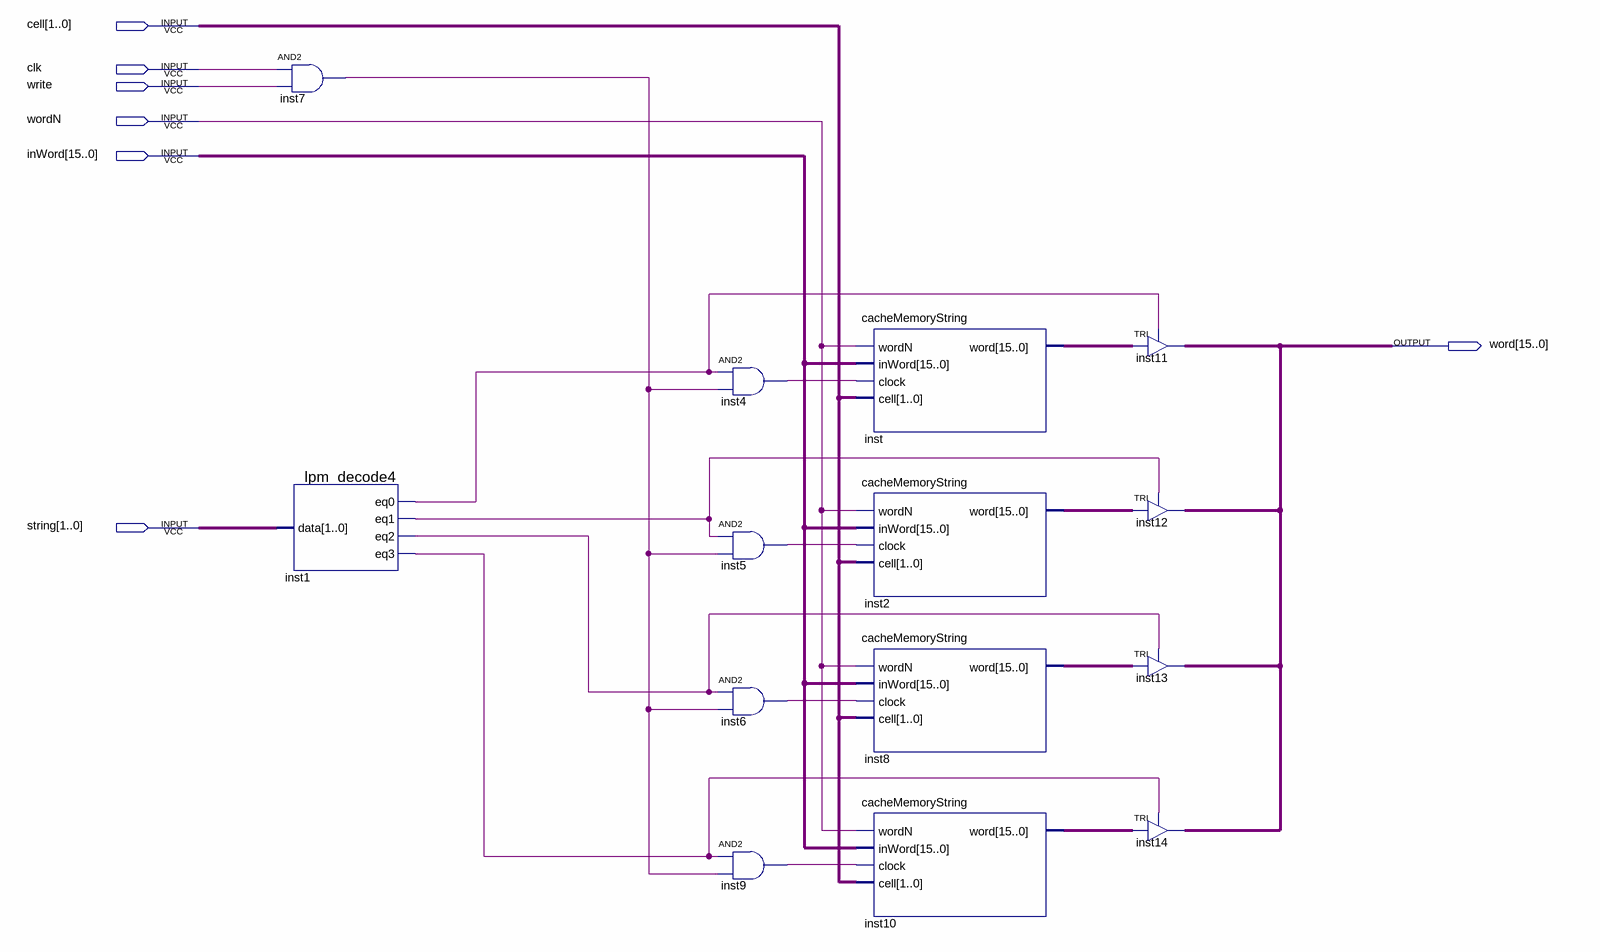
[diagram p0: schematic sheet]
// Quartus schematic cachememory.bdf as structural Verilog: 14 symbols, 7 pins
module cachememory (
  input  [1:0] \cell ,
  input  clk,
  input  write,
  input  wordN,
  input  [15:0] inWord,
  input  [1:0] \string ,
  output [15:0] word
);

  wire inst1_eq0, inst1_eq1, inst1_eq2, inst1_eq3, inst4_out, inst5_out, inst6_out, inst7_out, inst9_out;
  wire [15:0] inst2_word, inst8_word, inst10_word, inst_word;

  and inst7 (inst7_out, clk, write);
  lpm_decode4 inst1 (.data(\string ), .eq0(inst1_eq0), .eq1(inst1_eq1), .eq2(inst1_eq2), .eq3(inst1_eq3));
  and inst4 (inst4_out, inst1_eq0, inst7_out);
  and inst5 (inst5_out, inst1_eq1, inst7_out);
  and inst6 (inst6_out, inst1_eq2, inst7_out);
  and inst9 (inst9_out, inst1_eq3, inst7_out);
  cacheMemoryString inst (.wordN(wordN), .inWord(inWord), .clock(inst4_out), .\cell (\cell ), .word(inst_word));
  cacheMemoryString inst2 (.wordN(wordN), .inWord(inWord), .clock(inst5_out), .\cell (\cell ), .word(inst2_word));
  cacheMemoryString inst8 (.wordN(wordN), .inWord(inWord), .clock(inst6_out), .\cell (\cell ), .word(inst8_word));
  cacheMemoryString inst10 (.wordN(wordN), .inWord(inWord), .clock(inst9_out), .\cell (\cell ), .word(inst10_word));
  TRI inst11[15:0] (.IN(inst_word), .OE(inst1_eq0), .OUT(word));
  TRI inst12[15:0] (.IN(inst2_word), .OE(inst1_eq1), .OUT(word));
  TRI inst13[15:0] (.IN(inst8_word), .OE(inst1_eq2), .OUT(word));
  TRI inst14[15:0] (.IN(inst10_word), .OE(inst1_eq3), .OUT(word));
endmodule
